# EAGLE design a26-flashcart-v2 (EAGLE 7.5.0)
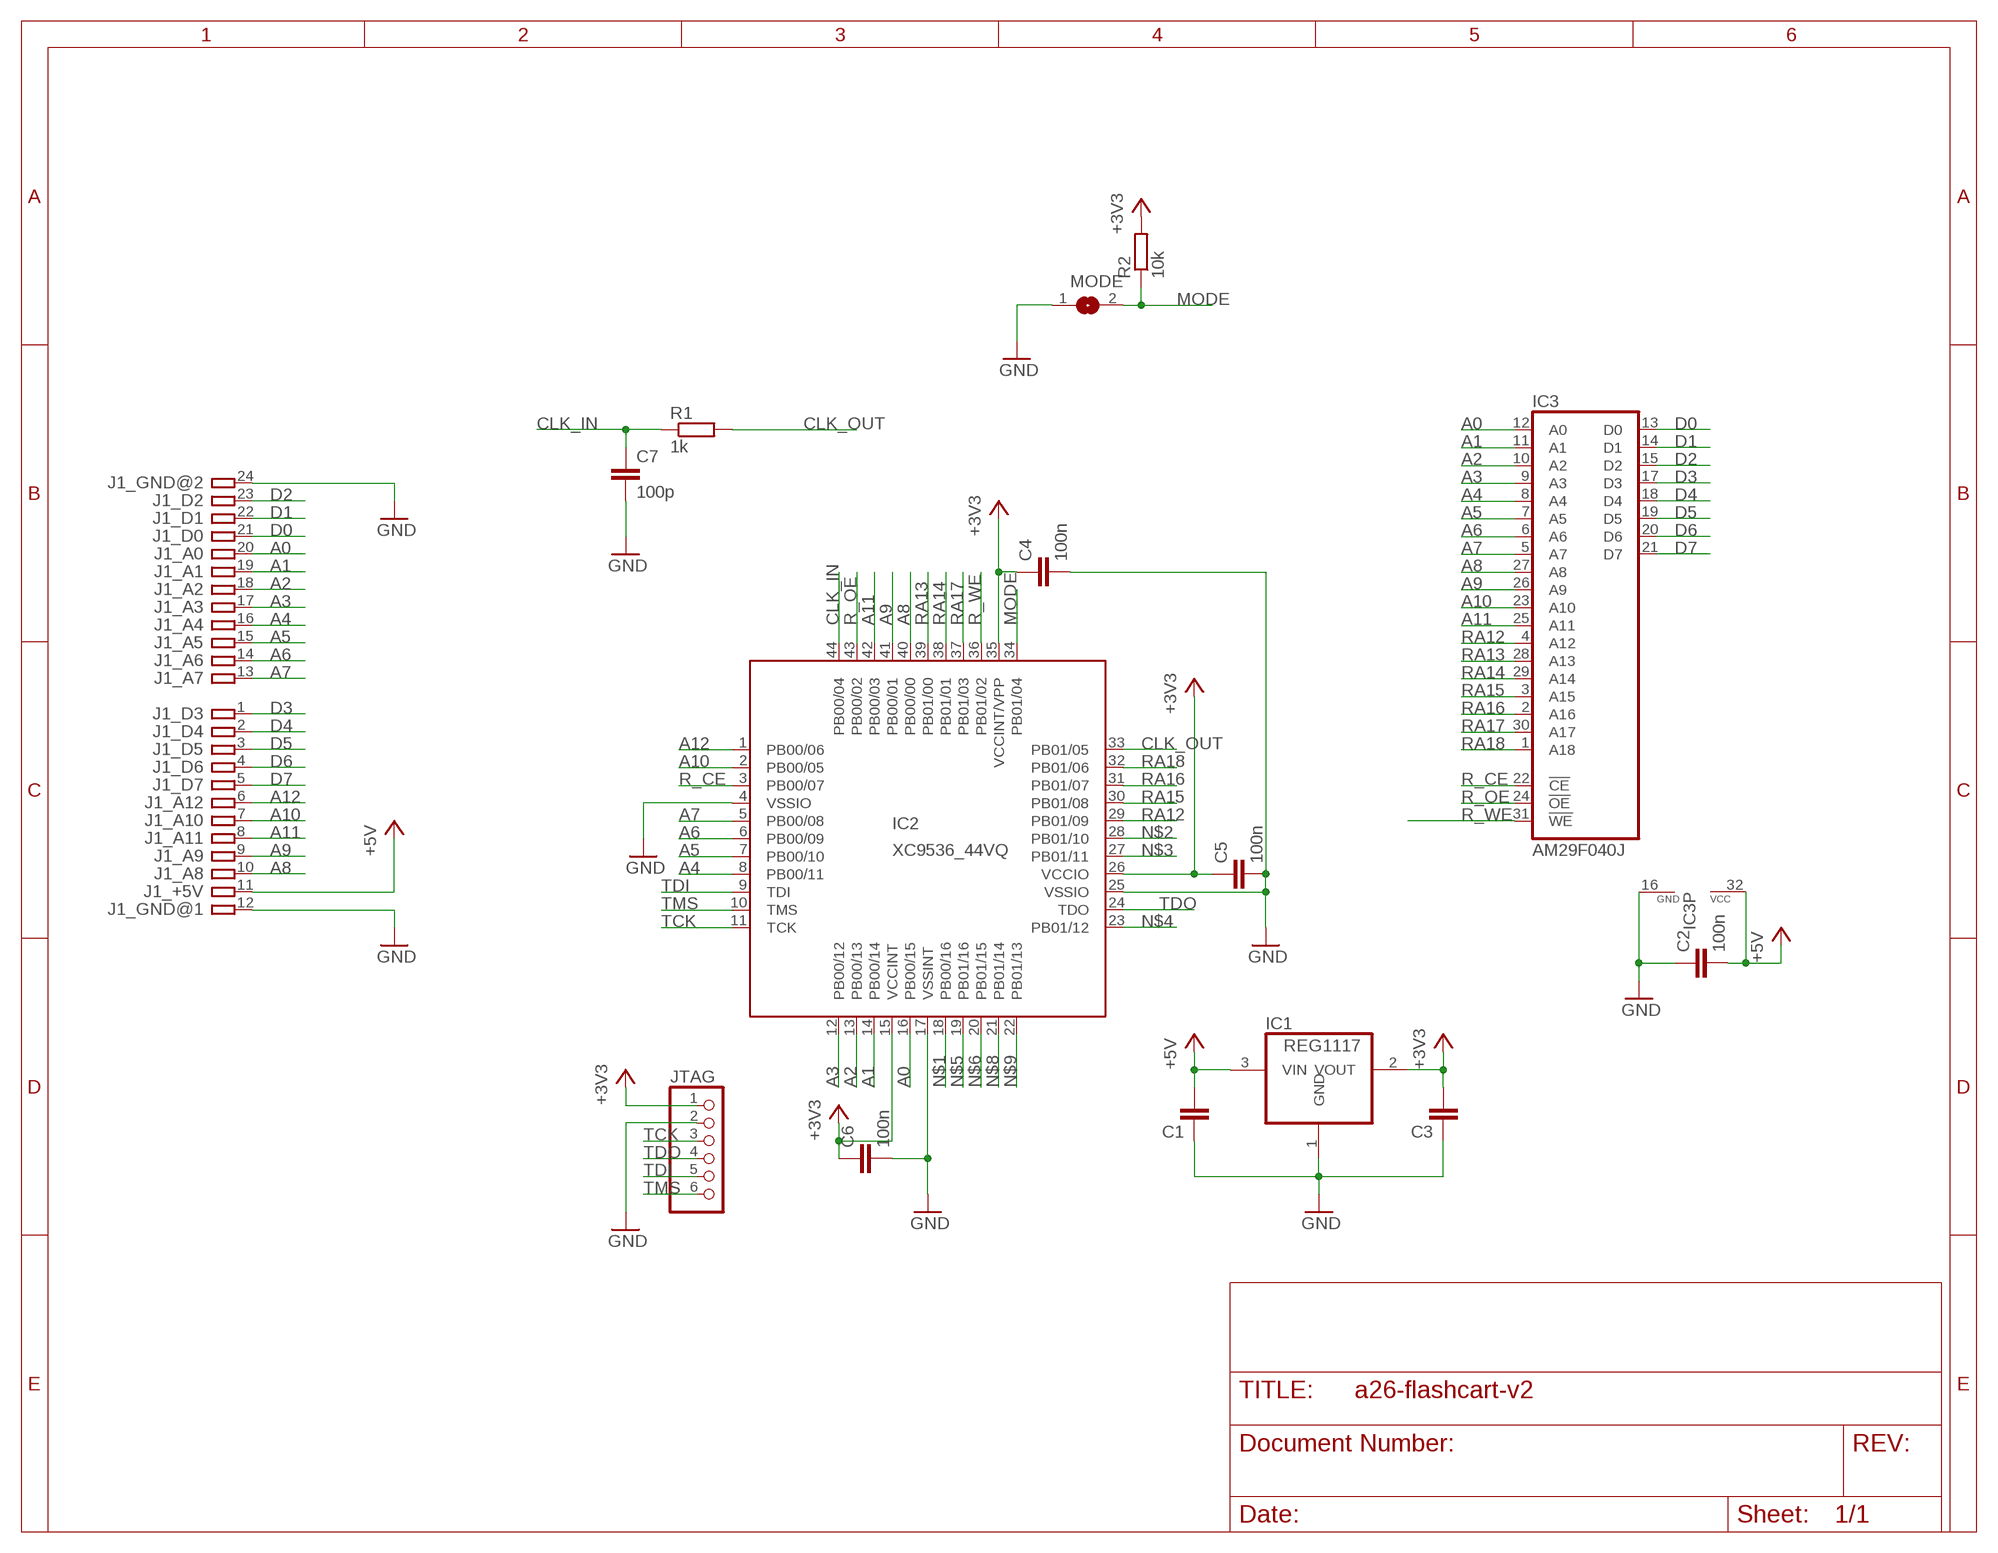
[diagram p0: schematic, sheet 1]

## Parts
C1  C-EUC0805  [C0805]
C2  100n  C-EUC0805  [C0805]
C3  C-EUC0805  [C0805]
C4  100n  C-EUC0805  [C0805]
C5  100n  C-EUC0805  [C0805]
C6  100n  C-EUC0805  [C0805]
C7  100p  C-EUC0805  [C0805]
IC1  REG1117  [SOT223]
IC2  XC9536_44VQ  [SQFP-S-10X10-44]
IC3  AM29F040J  [PLCC32R]
J1  ATARI-2600-SMALL  [ATARI-2600-SMALL]
JTAG  PINHD-1X6  [1X06]
MODE  SJ  [SJ]
R1  1k  R-EU_R0805  [R0805]
R2  10k  R-EU_R0805  [R0805]

## Nets
+3V3: C3.2 C4.1 C5.1 C6.1 IC1.2(VOUT) IC2.15(VCCINT) IC2.26(VCCIO) IC2.35(VCCINT/VPP) JTAG.1 R2.2
+5V: C1.2 C2.2 IC1.3(VIN) IC3.32(VCC) J1.11
A0: IC2.16(PB00/15) IC3.12(A0) J1.20
A1: IC2.14(PB00/14) IC3.11(A1) J1.19
A2: IC2.13(PB00/13) IC3.10(A2) J1.18
A3: IC2.12(PB00/12) IC3.9(A3) J1.17
A4: IC2.8(PB00/11) IC3.8(A4) J1.16
A5: IC2.7(PB00/10) IC3.7(A5) J1.15
A6: IC2.6(PB00/09) IC3.6(A6) J1.14
A7: IC2.5(PB00/08) IC3.5(A7) J1.13
A8: IC2.40(PB00/00) IC3.27(A8) J1.10
A9: IC2.41(PB00/01) IC3.26(A9) J1.9
A10: IC2.2(PB00/05) IC3.23(A10) J1.7
A11: IC2.42(PB00/03) IC3.25(A11) J1.8
A12: IC2.1(PB00/06) J1.6
CLK_IN: C7.1 IC2.44(PB00/04) R1.1
CLK_OUT: IC2.33(PB01/05) R1.2
D0: IC3.13(D0) J1.21
D1: IC3.14(D1) J1.22
D2: IC3.15(D2) J1.23
D3: IC3.17(D3) J1.1
D4: IC3.18(D4) J1.2
D5: IC3.19(D5) J1.3
D6: IC3.20(D6) J1.4
D7: IC3.21(D7) J1.5
GND: C1.1 C2.1 C3.1 C4.2 C5.2 C6.2 C7.2 IC1.1(GND) IC2.4(VSSIO) IC2.17(VSSINT) IC2.25(VSSIO) IC3.16(GND) J1.12 J1.24 JTAG.2 MODE.1
MODE: IC2.34(PB01/04) MODE.2 R2.1
N$1: IC2.18(PB00/16)
N$2: IC2.28(PB01/10)
N$3: IC2.27(PB01/11)
N$4: IC2.23(PB01/12)
N$5: IC2.19(PB01/16)
N$6: IC2.20(PB01/15)
N$8: IC2.21(PB01/14)
N$9: IC2.22(PB01/13)
R_CE: IC2.3(PB00/07) IC3.22(!CE)
R_OE: IC2.43(PB00/02) IC3.24(!OE)
R_WE: IC2.36(PB01/02) IC3.31(!WE)
RA12: IC2.29(PB01/09) IC3.4(A12)
RA13: IC2.39(PB01/00) IC3.28(A13)
RA14: IC2.38(PB01/01) IC3.29(A14)
RA15: IC2.30(PB01/08) IC3.3(A15)
RA16: IC2.31(PB01/07) IC3.2(A16)
RA17: IC2.37(PB01/03) IC3.30(A17)
RA18: IC2.32(PB01/06) IC3.1(A18)
TCK: IC2.11(TCK) JTAG.3
TDI: IC2.9(TDI) JTAG.5
TDO: IC2.24(TDO) JTAG.4
TMS: IC2.10(TMS) JTAG.6

## Library data of the parts
C1-C7 = resistor:C-EU: CAPACITOR, European symbol
IC1 = burr-brown:REG1117: 800mA and 1A Low Dropout (LDO) Positive Regulator 1.8V, 2.5V, 2.85V, 3.3V, 5V, and Adj; MPN: REG1117; OC_FARNELL: 1097566; OC_NEWARK: 14P6981
IC2 = xilinx-xc9:XC9536_44VQ: xc9536_pc44 XC9500 In-System Programmable CPLD Family Auto generated by make-symbol-device-package-bsdl.ulp Rev. 34 Source: xc9536_vq44.bsd; MPN: XC9536-15VQG44C; OC_FARNELL: 1193227; OC_NEWARK: 98K3377
IC3 = am29-memory:AM29F040J: 4-Megabit FLASH MEMORY (512 K x 8 bit) 5 V-only
J1 = atari-2600:ATARI-2600: Atari 2600 cartridge board
JTAG = adafruit:PINHD-1X6: PIN HEADER
MODE = jumper:SJ: SMD solder JUMPER
R1 R2 = resistor:R-EU_: RESISTOR, European symbol

## Board
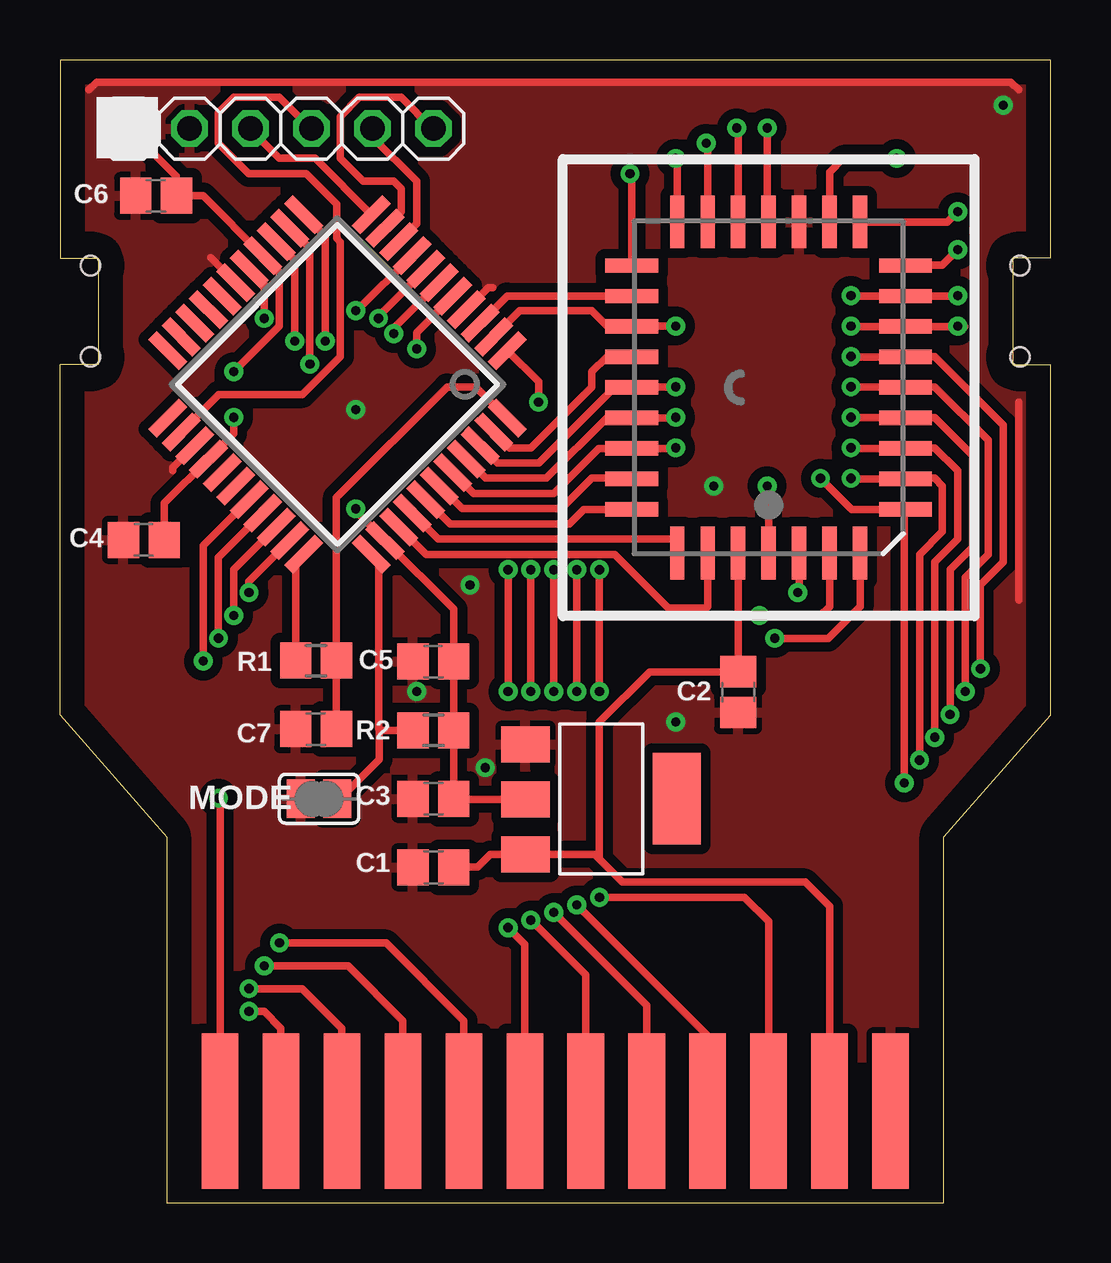
[diagram p1: board, top side]
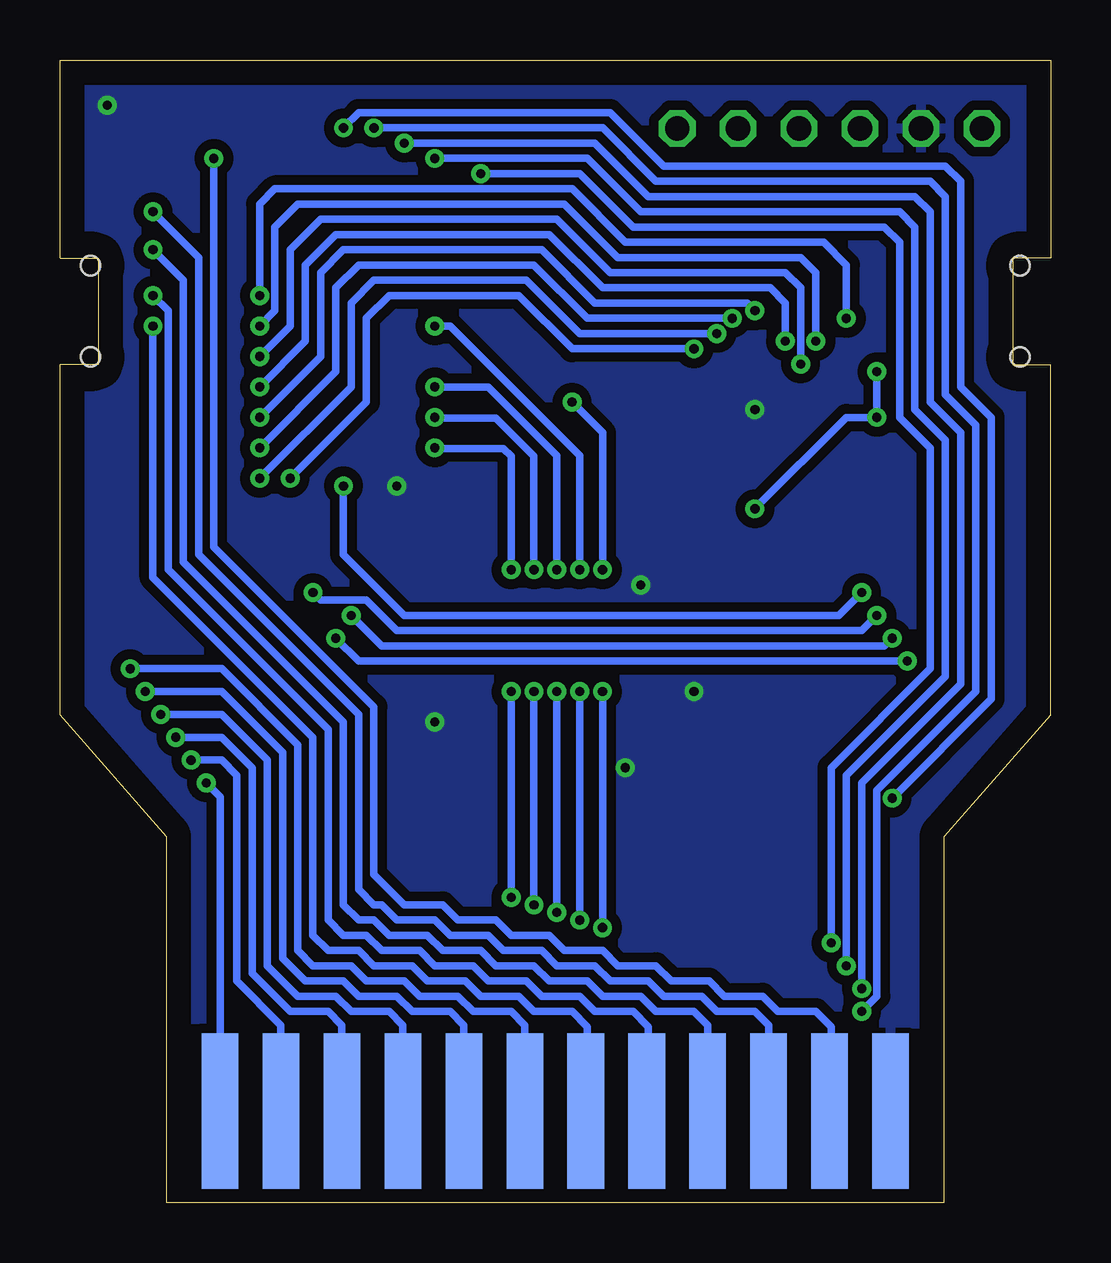
[diagram p2: board, bottom side, seen from below]

Size 41.27 x 47.62 mm. Coordinates in mm from the lower left corner, seen from the top.
Copper layers (1*16): Top 0.035mm / dielectric 1.5mm / Bottom 0.035mm
Design rules "default": minimum track width 10mil, minimum drill 24mil, track to track 8mil, track to pad 8mil, pad to pad 8mil, via to via 8mil, smd to smd 8mil, copper to edge 40mil, drill to drill 8mil, minimum pad ring 10mil, minimum via ring 8mil, stop-mask expansion 4mil, vias tented up to drill 0mil, thermal gap 10mil

### Footprints (pad centres in the part's own frame; a part is rotated, then mirrored left to right if it is on the bottom)
C0805 = smd 1.3 x 1.5: 1 -0.85,0; 2 0.85,0
SOT223 = smd 1.499 x 2.007: 1 -2.261,-3.15; 2 0.025,-3.15; 3 2.311,-3.15 | smd 3.81 x 2.007: 4 0,3.15
SQFP-S-10X10-44 = smd 0.5 x 1.8: 1 -4,-6; 2 -3.2,-6; 3 -2.4,-6; 4 -1.6,-6; 5 -0.8,-6; 6 0,-6; 7 0.8,-6; 8 1.6,-6; 9 2.4,-6; 10 3.2,-6; 11 4,-6; 23 4,6; 24 3.2,6; 25 2.4,6; 26 1.6,6; 27 0.8,6; 28 0,6; 29 -0.8,6; 30 -1.6,6; 31 -2.4,6; 32 -3.2,6; 33 -4,6 | smd 1.8 x 0.5: 12 6,-4; 13 6,-3.2; 14 6,-2.4; 15 6,-1.6; 16 6,-0.8; 17 6,0; 18 6,0.8; 19 6,1.6; 20 6,2.4; 21 6,3.2; 22 6,4; 34 -6,4; 35 -6,3.2; 36 -6,2.4; 37 -6,1.6; 38 -6,0.8; 39 -6,0; 40 -6,-0.8; 41 -6,-1.6; 42 -6,-2.4; 43 -6,-3.2; 44 -6,-4
PLCC32R = smd 0.6 x 2.2: 1 0,6.9; 2 -1.27,6.9; 3 -2.54,6.9; 4 -3.81,6.9; 14 -3.81,-6.9; 15 -2.54,-6.9; 16 -1.27,-6.9; 17 0,-6.9; 18 1.27,-6.9; 19 2.54,-6.9; 20 3.81,-6.9; 30 3.81,6.9; 31 2.54,6.9; 32 1.27,6.9 | smd 2.2 x 0.6: 5 -5.7,5.08; 6 -5.7,3.81; 7 -5.7,2.54; 8 -5.7,1.27; 9 -5.7,0; 10 -5.7,-1.27; 11 -5.7,-2.54; 12 -5.7,-3.81; 13 -5.7,-5.08; 21 5.7,-5.08; 22 5.7,-3.81; 23 5.7,-2.54; 24 5.7,-1.27; 25 5.7,0; 26 5.7,1.27; 27 5.7,2.54; 28 5.7,3.81; 29 5.7,5.08
ATARI-2600-SMALL = smd 1.524 x 6.477: 1 -13.97,3.81; 2 -11.43,3.81; 3 -8.89,3.81; 4 -6.35,3.81; 5 -3.81,3.81; 6 -1.27,3.81; 7 1.27,3.81; 8 3.81,3.81; 9 6.35,3.81; 10 8.89,3.81; 11 11.43,3.81; 12 13.97,3.81 | smd 1.524 x 6.477 bottom: 13 13.97,3.81; 14 11.43,3.81; 15 8.89,3.81; 16 6.35,3.81; 17 3.81,3.81; 18 1.27,3.81; 19 -1.27,3.81; 20 -3.81,3.81; 21 -6.35,3.81; 22 -8.89,3.81; 23 -11.43,3.81; 24 -13.97,3.81 | hole 0.8: -19.367,39.053; -19.367,35.242; 19.367,39.053; 19.367,35.242
1X06 = drill 1.016 octagon: 1 -6.35,0; 2 -3.81,0; 3 -1.27,0; 4 1.27,0; 5 3.81,0; 6 6.35,0
SJ = smd 1.168 x 1.6: 1 -0.762,0; 2 0.762,0
R0805 = smd 1.3 x 1.5: 1 -0.85,0; 2 0.85,0

### Placement (x,y rotation side)
C1  15.56,13.97 0 top
C2  28.26,21.27 90 top
C3  15.56,16.83 0 top
C4  3.49,27.62 180 top
C5  15.56,22.54 180 top
C6  4,41.96 180 top
C7  10.67,19.74 180 top
IC1  22.54,16.83 270 top
IC2  11.56,34.1 135 top
IC3  29.53,33.97 180 top
J1  20.64,0 0 top
JTAG  9.21,44.77 0 top
MODE  10.79,16.83 0 top
R1  10.67,22.59 180 top
R2  15.56,19.68 0 top

### Tracks (layer width: path | path; a pad name or v marks a point on that pad's centre or on a via)
+3V3  (via drill 0.38)
  Top 0.305: IC1.2 16.43,16.8 C3.2 R2.2 C5.1 16.41,24.73 IC2.35 12.32,28.82 v12.32,28.92 | JTAG.1 4.85,42.77 C6.1 5.97,41.96 IC2.15 9.14,38.78 9.14,36.54 v7.24,34.63 | C4.1 4.34,29.15 IC2.26 7.24,32.04 v7.24,32.73
  Bottom 0.305: v12.32,28.92 8.51,32.73 v7.24,32.73 v7.24,34.63
+5V
  Top 0.305: C1.2 16.43,13.99 17.4,13.99 17.92,14.52 IC1.3 22.28,14.52 22.48,14.31 | IC3.32 C2.2 24.57,22.12 22.48,20.03 22.48,14.31 | J1.11 32.07,12.34 31.05,13.36 23.43,13.36 22.48,14.31
A0  (via drill 0.38)
  Top 0.305: v37.4,37.81 37.38,37.78 IC3.12 32.98,37.78 v32.96,37.81 | IC2.16 8.51,38.29 v8.51,36.86
  Bottom 0.305: J1.20 16.76,3.87 16.76,7.33 17.4,7.96 18.99,7.96 19.62,8.6 21.21,8.6 21.84,9.23 23.43,9.23 24.07,9.87 25.65,9.87 26.29,10.5 27.88,10.5 28.51,11.14 29.46,11.14 30.1,11.77 30.1,19.71 36.77,26.38 36.77,37.17 v37.4,37.81 | v8.51,36.86 8.51,39.08 9.46,40.03 17.72,40.03 19.94,42.25 32.32,42.25 32.96,41.62 v32.96,37.81
A1  (via drill 0.38)
  Top 0.305: v37.4,36.54 37.69,36.51 IC3.11 32.98,36.51 v32.96,36.54 | IC2.14 9.78,39.28 v9.78,35.9
  Bottom 0.305: J1.19 19.3,3.87 19.3,7.33 19.94,7.96 21.53,7.96 22.16,8.6 23.75,8.6 24.38,9.23 25.97,9.23 26.61,9.87 28.19,9.87 28.83,10.5 30.1,10.5 30.73,11.14 30.73,19.39 37.4,26.06 v37.4,36.54 | v9.78,35.9 9.78,38.76 10.41,39.4 18.03,39.4 20.26,41.62 31.37,41.62 32.32,40.67 32.32,37.17 v32.96,36.54
A2  (via drill 0.38)
  Top 0.305: v38.35,22.25 38.35,25.74 39.31,26.7 39.31,32.41 36.45,35.27 35.25,35.27 IC3.10 32.98,35.24 v32.96,35.27 | IC2.13 10.41,39.78 v10.41,34.95
  Bottom 0.305: J1.18 21.91,7.39 22.48,7.96 24.07,7.96 24.7,8.6 26.29,8.6 26.92,9.23 28.51,9.23 29.15,9.87 30.73,9.87 31.37,10.5 31.37,19.07 34.54,22.25 v38.35,22.25 | v10.41,34.95 10.41,38.12 11.05,38.76 18.35,38.76 20.57,40.98 30.42,40.98 31.69,39.71 31.69,36.54 v32.96,35.27
A3  (via drill 0.38)
  Top 0.305: v37.72,21.3 37.72,26.06 38.67,27.01 38.67,31.78 36.45,34 35.25,34 | 35.25,34 IC3.9 | IC2.12 11.05,40.27 v11.05,35.9 | v32.96,34 35.25,34
  Bottom 0.305: J1.17 24.45,7.39 25.02,7.96 26.61,7.96 27.24,8.6 28.83,8.6 29.46,9.23 31.05,9.23 32,10.18 32,18.76 34.54,21.3 v37.72,21.3 | v11.05,35.9 11.05,37.49 11.68,38.12 18.67,38.12 20.89,40.35 29.78,40.35 31.05,39.08 31.05,35.9 v32.96,34
A4  (via drill 0.38)
  Top 0.305: v37.08,20.34 37.08,26.38 38.04,27.33 38.04,31.14 36.45,32.73 35.25,32.73 | 35.25,32.73 IC3.8 | IC2.8 12.37,37.17 v12.32,37.17 | v32.96,32.73 35.25,32.73
  Bottom 0.305: J1.16 26.99,7.39 27.56,7.96 29.15,7.96 29.78,8.6 31.37,8.6 32.64,9.87 32.64,18.44 34.54,20.34 v37.08,20.34 | v12.32,37.17 12.64,37.49 18.99,37.49 21.21,39.71 29.46,39.71 30.42,38.76 30.42,35.27 v32.96,32.73
A5  (via drill 0.38)
  Top 0.305: v36.45,19.39 36.45,26.7 37.4,27.65 37.4,30.5 36.45,31.46 35.25,31.46 IC3.7 32.98,31.43 v32.96,31.46 | IC2.7 13.27,36.94 v13.27,36.86
  Bottom 0.305: J1.15 29.53,7.39 30.1,7.96 31.69,7.96 33.27,9.55 33.27,18.12 34.54,19.39 v36.45,19.39 | v13.27,36.86 19.3,36.86 21.53,39.08 28.83,39.08 29.78,38.12 29.78,34.63 v32.96,31.46
A6  (via drill 0.38)
  Top 0.305: v35.81,18.44 35.81,27.01 36.77,27.97 36.77,29.87 36.45,30.19 35.25,30.19 IC3.6 32.98,30.16 v32.96,30.19 | IC2.6 13.91,36.45 v13.91,36.22
  Bottom 0.305: J1.14 32.07,7.39 33.91,9.23 33.91,17.81 34.54,18.44 v35.81,18.44 | v13.91,36.22 19.62,36.22 21.84,38.44 28.19,38.44 29.15,37.49 29.15,34 v32.96,30.19
A7  (via drill 0.38)
  Top 0.305: v35.18,17.49 35.18,28.53 IC3.5 32.98,28.89 v31.69,30.19 | IC2.5 14.86,36.27 v14.86,35.58
  Bottom 0.305: J1.13 34.61,16.92 v35.18,17.49 | v14.86,35.58 19.94,35.58 22.16,37.81 27.56,37.81 28.51,36.86 28.51,33.36 v31.69,30.19
A8  (via drill 0.38)
  Top 0.305: IC2.40 17.24,29.55 20.57,29.55 22.45,31.43 IC3.27 25.63,31.43 v25.65,31.46 | J1.10 29.53,11.71 28.51,12.73 v22.48,12.73 | v22.48,21.3 v22.48,26.38
  Bottom 0.305: v22.48,12.73 v22.48,21.3 | v22.48,26.38 22.48,31.11 22.8,31.43 25.63,31.43 v25.65,31.46
A9  (via drill 0.38)
  Top 0.305: IC2.41 17.74,30.19 20.26,30.19 22.77,32.7 IC3.26 25.63,32.7 v25.65,32.73 | J1.9 26.99,6.95 v21.53,12.41 | v21.53,21.3 v21.53,26.38
  Bottom 0.305: v21.53,12.41 v21.53,21.3 | v21.53,26.38 21.53,31.11 23.11,32.7 25.63,32.7 v25.65,32.73
A10  (via drill 0.38)
  Top 0.305: IC2.2 19.16,37.17 22.16,37.17 22.82,36.51 IC3.23 23.85,36.54 v25.65,36.54 | J1.7 21.91,9.49 v19.62,11.77 | v19.62,21.3 v19.62,26.38
  Bottom 0.305: v19.62,11.77 v19.62,21.3 | v19.62,26.38 19.62,31.14 25.02,36.54 v25.65,36.54
A11  (via drill 0.38)
  Top 0.305: IC2.42 18.24,30.82 19.94,30.82 23.09,33.97 IC3.25 23.85,34 v25.65,34 | J1.8 24.45,8.22 v20.57,12.09 | v20.57,21.3 v20.57,26.38
  Bottom 0.305: v20.57,12.09 v20.57,21.3 | v20.57,26.38 20.57,31.14 23.43,34 v25.65,34
A12  (via drill 0.38)
  Top 0.305: J1.6 19.37,10.76 v18.67,11.46 | v18.67,21.3 v18.67,26.38 | v19.94,33.36 19.94,34.21 IC2.1
  Bottom 0.305: v18.67,11.46 v18.67,21.3 | v18.67,26.38 18.67,32.09 v19.94,33.36
CLK_IN
  Top 0.305: C7.1 R1.1 11.52,29.39 16.13,34 17.32,34 IC2.44
CLK_OUT
  Top 0.305: R1.2 9.82,26.7 IC2.33
D0  (via drill 0.38)
  Top 0.305: v37.4,39.71 36.77,39.08 35.25,39.08 IC3.13
  Bottom 0.305: J1.21 14.29,7.39 14.86,7.96 16.45,7.96 17.08,8.6 18.67,8.6 19.3,9.23 20.89,9.23 21.53,9.87 23.11,9.87 23.75,10.5 25.34,10.5 25.97,11.14 27.56,11.14 28.19,11.77 28.83,11.77 29.46,12.41 29.46,20.03 36.13,26.7 36.13,38.44 v37.4,39.71
D1  (via drill 0.38)
  Top 0.305: v37.4,41.3 36.97,40.87 IC3.14
  Bottom 0.305: J1.22 11.75,7.39 12.32,7.96 13.91,7.96 14.54,8.6 16.13,8.6 16.76,9.23 18.35,9.23 18.99,9.87 20.57,9.87 21.21,10.5 22.8,10.5 23.43,11.14 25.02,11.14 25.65,11.77 27.24,11.77 27.88,12.41 28.19,12.41 28.83,13.04 28.83,20.34 35.5,27.01 35.5,39.4 v37.4,41.3
D2  (via drill 0.38)
  Top 0.305: v34.86,43.52 32.64,43.52 32.07,42.95 IC3.15
  Bottom 0.305: J1.23 9.14,3.87 9.14,7.33 9.78,7.96 11.37,7.96 12,8.6 13.59,8.6 14.22,9.23 15.81,9.23 16.45,9.87 18.03,9.87 18.67,10.5 20.26,10.5 20.89,11.14 22.48,11.14 23.11,11.77 24.7,11.77 25.34,12.41 26.92,12.41 28.19,13.68 28.19,20.66 34.86,27.33 v34.86,43.52
D3  (via drill 0.38)
  Top 0.305: v29.46,44.79 29.46,40.94 IC3.17 | J1.1 6.67,16.79 v6.6,16.85
  Bottom 0.305: v29.46,44.79 28.83,45.43 18.35,45.43 16.13,43.21 4.38,43.21 3.75,42.57 3.75,34 2.48,32.73 2.48,20.98 v6.6,16.85
D4  (via drill 0.38)
  Top 0.305: J1.2 9.21,7.26 8.51,7.96 v7.87,7.96 | v28.19,44.79 28.26,44.73 IC3.18
  Bottom 0.305: v28.19,44.79 18.67,44.79 16.45,42.57 5.02,42.57 4.38,41.93 4.38,33.68 3.11,32.41 3.11,21.3 7.24,17.17 7.24,8.6 v7.87,7.96
D5  (via drill 0.38)
  Top 0.305: IC3.19 26.99,44.09 v26.92,44.16 | v7.87,8.91 10.1,8.91 11.75,7.26 J1.3
  Bottom 0.305: v26.92,44.16 18.99,44.16 16.76,41.93 5.65,41.93 5.02,41.3 5.02,33.36 3.75,32.09 3.75,21.61 7.87,17.49 v7.87,8.91
D6  (via drill 0.38)
  Top 0.305: J1.4 14.29,7.58 12,9.87 v8.51,9.87 | v25.65,43.52 25.72,43.46 IC3.20
  Bottom 0.305: v8.51,9.87 8.51,17.81 4.38,21.93 4.38,31.78 5.65,33.04 5.65,40.67 6.29,41.3 17.08,41.3 19.3,43.52 v25.65,43.52
D7  (via drill 0.38)
  Top 0.305: J1.5 16.83,7.58 13.59,10.82 v9.14,10.82 | v23.75,42.89 23.83,42.81 IC3.21
  Bottom 0.305: v9.14,10.82 9.14,18.12 5.02,22.25 5.02,31.46 6.29,32.73 6.29,40.03 6.92,40.67 17.4,40.67 19.62,42.89 v23.75,42.89
GND  (via drill 0.38)
  Top 0.305: IC2.25 4.7,30.64 4.7,30.5 | IC2.17 6.29,39.38 6.29,39.4 | IC2.4 17.85,38.12 18.03,38.12 | 39.94,33.36 39.94,25.11 | 1.21,46.38 1.52,46.7 39.62,46.7 39.94,46.38
  other vias: 14.86,21.3 17.72,18.12 25.65,20.03 39.31,45.75 12.32,33.05 17.08,25.74 27.24,29.87
  pour Top (isolate 0.406): 0.32,48.26 40.96,48.26 40.96,19.05 37.15,15.24 37.15,6.03 4.13,6.03 4.13,16.51 0.32,20.32
  pour Bottom (isolate 0.406): 0.32,48.26 40.96,48.26 40.96,19.05 37.15,15.24 37.15,6.03 4.13,6.03 4.13,16.51 0.32,20.32
MODE
  Top 0.305: 14.41,19.68 R2.1 13.3,19.68 | IC2.34 13.27,26.74 13.27,19.71 13.3,19.68 | MODE.2 11.58,16.85 11.68,16.85 13.3,18.47 13.3,19.68
R_CE
  Top 0.305: IC2.3 18.63,37.78 IC3.22
R_OE
  Top 0.305: IC2.43 18.73,31.46 19.62,31.46 22.16,34 22.16,34.63 22.77,35.24 IC3.24
R_WE
  Top 0.305: IC2.36 15.26,27.01 23.11,27.01 25.34,24.79 26.92,24.79 26.99,24.85 IC3.31
RA12  (via drill 0.38)
  Top 0.305: IC3.4 33.34,24.85 32,23.52 v29.78,23.52 | v5.97,22.57 5.97,27.38 IC2.29
  Bottom 0.305: v29.78,23.52 28.83,22.57 v5.97,22.57
RA13
  Top 0.305: IC2.39 15.82,29.86 16.76,28.92 20.89,28.92 22.16,30.19 23.8,30.19 IC3.28
RA14
  Top 0.305: IC2.38 16.25,28.28 21.21,28.28 21.82,28.89 IC3.29
RA15  (via drill 0.38)
  Top 0.305: IC3.3 32.07,24.85 31.69,24.47 v29.15,24.47 | v6.6,23.52 6.6,26.88 IC2.30
  Bottom 0.305: v29.15,24.47 27.88,23.2 6.92,23.2 v6.6,23.52
RA16  (via drill 0.38)
  Top 0.305: IC3.2 30.8,25.49 v30.73,25.43 | v7.24,24.47 7.24,26.39 IC2.31
  Bottom 0.305: v30.73,25.43 30.42,25.11 28.51,25.11 27.24,23.84 7.87,23.84 v7.24,24.47
RA17
  Top 0.305: IC2.37 15.75,27.65 25.65,27.65 25.72,27.58 IC3.30
RA18  (via drill 0.38)
  Top 0.305: IC3.1 29.53,29.81 v29.46,29.87 | v7.87,25.43 7.87,25.89 IC2.32
  Bottom 0.305: v29.46,29.87 29.46,27.01 26.92,24.47 8.83,24.47 v7.87,25.43
TCK
  Top 0.305: IC2.11 10.63,43.52 9.14,43.52 7.94,44.73 JTAG.3
TDI
  Top 0.305: IC2.9 14.86,40.8 14.86,42.57 13.02,44.41 JTAG.5
TDO
  Top 0.305: JTAG.4 10.44,44.77 9.14,46.06 7.24,46.06 6.6,45.43 6.6,44.16 7.87,42.89 10.26,42.89 11.53,41.62 11.53,40.19 11.68,40.03 11.68,35.27 10.1,33.68 6.61,33.68 IC2.24
TMS
  Top 0.305: IC2.10 14.22,41.29 14.22,42.25 13.91,42.57 12.64,42.57 11.68,43.52 11.68,45.27 12.48,46.06 14.22,46.06 15.52,44.77 JTAG.6

### Text on the board
tStop: tDIdIDiT
tKeepout: tDIdIDiT